# Altium project Valve-Relay.PrjPcb
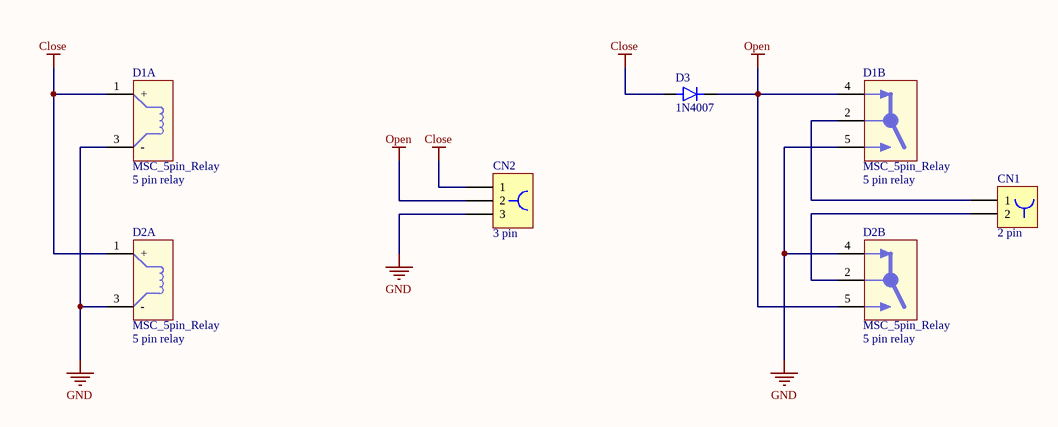
[diagram p0: main.SchDoc]
1 sheet, 5 parts. Net scope: global (net labels, ports and power ports of the same name join across sheets).
Board file: main.PcbDoc

## Sheet main.SchDoc
size A

### Parts
CN1  Value1: 2 pin  [CN_WURTH_691216510002]  (hidden comment: CN_1X2F)
CN2  Value1: 3 pin  [CN_WURTH_691216510003]  (hidden comment: CN_1X3F)
D1  MSC_5pin_Relay  Value1: 5 pin relay  [MSC_SRA-12VDC-CL]  (parts A,B of 2)
D2  MSC_5pin_Relay  Value1: 5 pin relay  [MSC_SRA-12VDC-CL]  (parts A,B of 2)
D3  Value1: 1N4007  [DIO_Fairchild_1N4007]  (hidden comment: DIO)

### Nets
Close: CN2.1 D1.1(+) D2.1(+) D3.2(A)
GND: CN2.3 D1.3(-) D1.5 D2.3(-) D2.4
Open: CN2.2 D1.4 D2.5 D3.1(K)
NetCN1_1: CN1.1 D1.2
NetCN1_2: CN1.2 D2.2

### Library data of the parts
CN1 = 02_00092: WURTH ELEKTRONIK - 691216510002 - T/BLOCK, 5.08MM; AutoId: 92; DeviceType: Connector_2; Id: 02_00092; Manufacturer: Wurth; Manufacturer PN: 691216510002; Status: 0 - Unchecked; MountType: THT; ComponentLink1Description: Datasheet; ComponentLink1URL: X:\01_dataSheets\CN_WURTH_69121651000x.pdf; ComponentLink2Description: ComponentVerificationSheet; ComponentLink2URL: X:\02_ComponentVerificationSheets\; Supplier 1: Farnell; Supplier Part Number 1: 1841252
CN2 = 02_00091: WURTH ELEKTRONIK 691216510003 - T/BLOCK, 5,08mm 3W; AutoId: 91; DeviceType: Connector_3; Id: 02_00091; Manufacturer: Wurth; Manufacturer PN: 691216510003; Status: 0 - Unchecked; MountType: THT; ComponentLink1Description: Datasheet; ComponentLink1URL: X:\01_dataSheets\CN_WURTH_69121651000x.pdf; ComponentLink2Description: ComponentVerificationSheet; ComponentLink2URL: X:\02_ComponentVerificationSheets\; Supplier 1: Farnell; Supplier Part Number 1: 1841253
D1 D2 = 12_00143: Manufacturer: SRA; Manufacturer PN: SRA-12VDC-CL; AutoId: 154; Value2: relay; Value3: 12V; DeviceType: misc; Id: 12_00143; Status: 0 - Unchecked; MountType: THD; ComponentLink1Description: Datasheet; ComponentLink1URL: X:\01_Datasheets\; ComponentLink2Description: ComponentVerificationSheet; ComponentLink2URL: X:\02_ComponentVerificationSheets\
D3 = 03_00065: Rectifiers Vr/1000V Io/1A; AutoId: 65; Value3: Fairchild; DeviceType: diode; Id: 03_00065; Value2: 1000V Io/1A; Manufacturer: Fairchild; Manufacturer PN: 1N4007; SubType: Rectifier; Status: 0 - Unchecked; MountType: SMD; ComponentLink1Description: Datasheet; ComponentLink1URL: X:\01_Datasheets\DIO_Fairchild_1N4007.pdf; ComponentLink2Description: ComponentVerificationSheet; ComponentLink2URL: X:\02_ComponentVerificationSheets\; Supplier 1: Mouser; Supplier Part Number 1: 512-1N4007